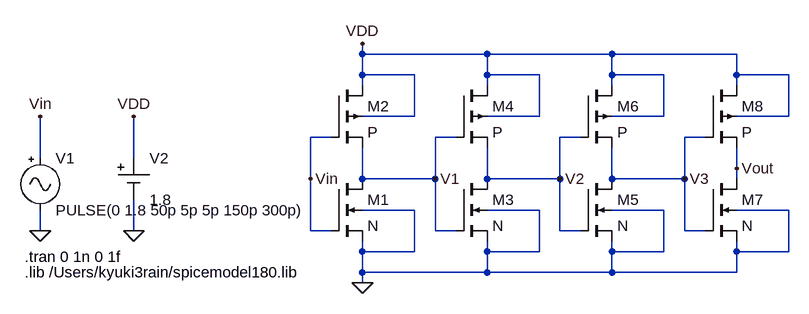
[diagram p0: schematic Draft1.asc]
Draft1.asc, the LTspice schematic file:
Version 4
SHEET 1 1140 680
WIRE 480 144 480 128
WIRE 672 144 480 144
WIRE 864 144 672 144
WIRE 1056 144 864 144
WIRE 480 176 480 144
WIRE 560 176 480 176
WIRE 672 176 672 144
WIRE 752 176 672 176
WIRE 864 176 864 144
WIRE 944 176 864 176
WIRE 1056 176 1056 144
WIRE 1136 176 1056 176
WIRE 480 192 480 176
WIRE 672 192 672 176
WIRE 864 192 864 176
WIRE 1056 192 1056 176
WIRE 560 240 560 176
WIRE 560 240 480 240
WIRE 752 240 752 176
WIRE 752 240 672 240
WIRE 944 240 944 176
WIRE 944 240 864 240
WIRE 1136 240 1136 176
WIRE 1136 240 1056 240
WIRE 432 272 400 272
WIRE 624 272 592 272
WIRE 816 272 784 272
WIRE 1008 272 976 272
WIRE -16 304 -16 240
WIRE 128 304 128 240
WIRE 1056 320 1056 288
WIRE 400 336 400 272
WIRE 480 336 480 288
WIRE 592 336 592 272
WIRE 592 336 480 336
WIRE 672 336 672 288
WIRE 784 336 784 272
WIRE 784 336 672 336
WIRE 864 336 864 288
WIRE 976 336 976 272
WIRE 976 336 864 336
WIRE 1056 336 1056 320
WIRE 560 384 480 384
WIRE 752 384 672 384
WIRE 944 384 864 384
WIRE 1136 384 1056 384
WIRE -16 416 -16 384
WIRE 128 416 128 368
WIRE 400 416 400 336
WIRE 432 416 400 416
WIRE 592 416 592 336
WIRE 624 416 592 416
WIRE 784 416 784 336
WIRE 816 416 784 416
WIRE 976 416 976 336
WIRE 1008 416 976 416
WIRE 480 448 480 432
WIRE 560 448 560 384
WIRE 560 448 480 448
WIRE 672 448 672 432
WIRE 752 448 752 384
WIRE 752 448 672 448
WIRE 864 448 864 432
WIRE 944 448 944 384
WIRE 944 448 864 448
WIRE 1056 448 1056 432
WIRE 1136 448 1136 384
WIRE 1136 448 1056 448
WIRE 480 480 480 448
WIRE 672 480 672 448
WIRE 672 480 480 480
WIRE 864 480 864 448
WIRE 864 480 672 480
WIRE 1056 480 1056 448
WIRE 1056 480 864 480
WIRE 480 496 480 480
FLAG -16 416 0
FLAG 128 416 0
FLAG 480 496 0
FLAG 128 240 VDD
FLAG 480 128 VDD
FLAG 400 336 Vin
FLAG -16 240 Vin
FLAG 592 336 V1
FLAG 784 336 V2
FLAG 976 336 V3
FLAG 1056 320 Vout
SYMBOL nmos4 432 336 R0
SYMATTR InstName M1
SYMATTR Value N
SYMATTR Value2 l=180n w=1u
SYMBOL pmos4 432 192 R0
SYMATTR InstName M2
SYMATTR Value P
SYMATTR Value2 l=180n w=1u
SYMBOL Misc/signal -16 288 R0
SYMATTR InstName V1
SYMATTR Value PULSE(0 1.8 50p 5p 5p 150p 300p)
SYMBOL Misc/cell 128 304 R0
SYMATTR InstName V2
SYMATTR Value 1.8
SYMBOL nmos4 624 336 R0
SYMATTR InstName M3
SYMATTR Value N
SYMATTR Value2 l=180n w=1u
SYMBOL pmos4 624 192 R0
SYMATTR InstName M4
SYMATTR Value P
SYMATTR Value2 l=180n w=1u
SYMBOL nmos4 816 336 R0
SYMATTR InstName M5
SYMATTR Value N
SYMATTR Value2 l=180n w=1u
SYMBOL pmos4 816 192 R0
SYMATTR InstName M6
SYMATTR Value P
SYMATTR Value2 l=180n w=1u
SYMBOL nmos4 1008 336 R0
SYMATTR InstName M7
SYMATTR Value N
SYMATTR Value2 l=180n w=1u
SYMBOL pmos4 1008 192 R0
SYMATTR InstName M8
SYMATTR Value P
SYMATTR Value2 l=180n w=1u
TEXT -40 456 Left 2 !.tran 0 1n 0 1f
TEXT -40 480 Left 2 !.lib /Users/kyuki3rain/spicemodel180.lib

The netlist it stands for:
* Draft1.asc
M1 V1 Vin 0 0 N l=180n w=1u
M2 VDD Vin V1 VDD P l=180n w=1u
V1 Vin 0 PULSE(0 1.8 50p 5p 5p 150p 300p)
V2 VDD 0 1.8
M3 V2 V1 0 0 N l=180n w=1u
M4 VDD V1 V2 VDD P l=180n w=1u
M5 V3 V2 0 0 N l=180n w=1u
M6 VDD V2 V3 VDD P l=180n w=1u
M7 Vout V3 0 0 N l=180n w=1u
M8 VDD V3 Vout VDD P l=180n w=1u
.model NMOS NMOS
.model PMOS PMOS
.lib standard.mos
.tran 0 1n 0 1f
.lib /Users/kyuki3rain/spicemodel180.lib
.backanno
.end